# Altium schematic sheet MaUWB.SchDoc
size A; SheetNumber: 3; SheetTotal: 5
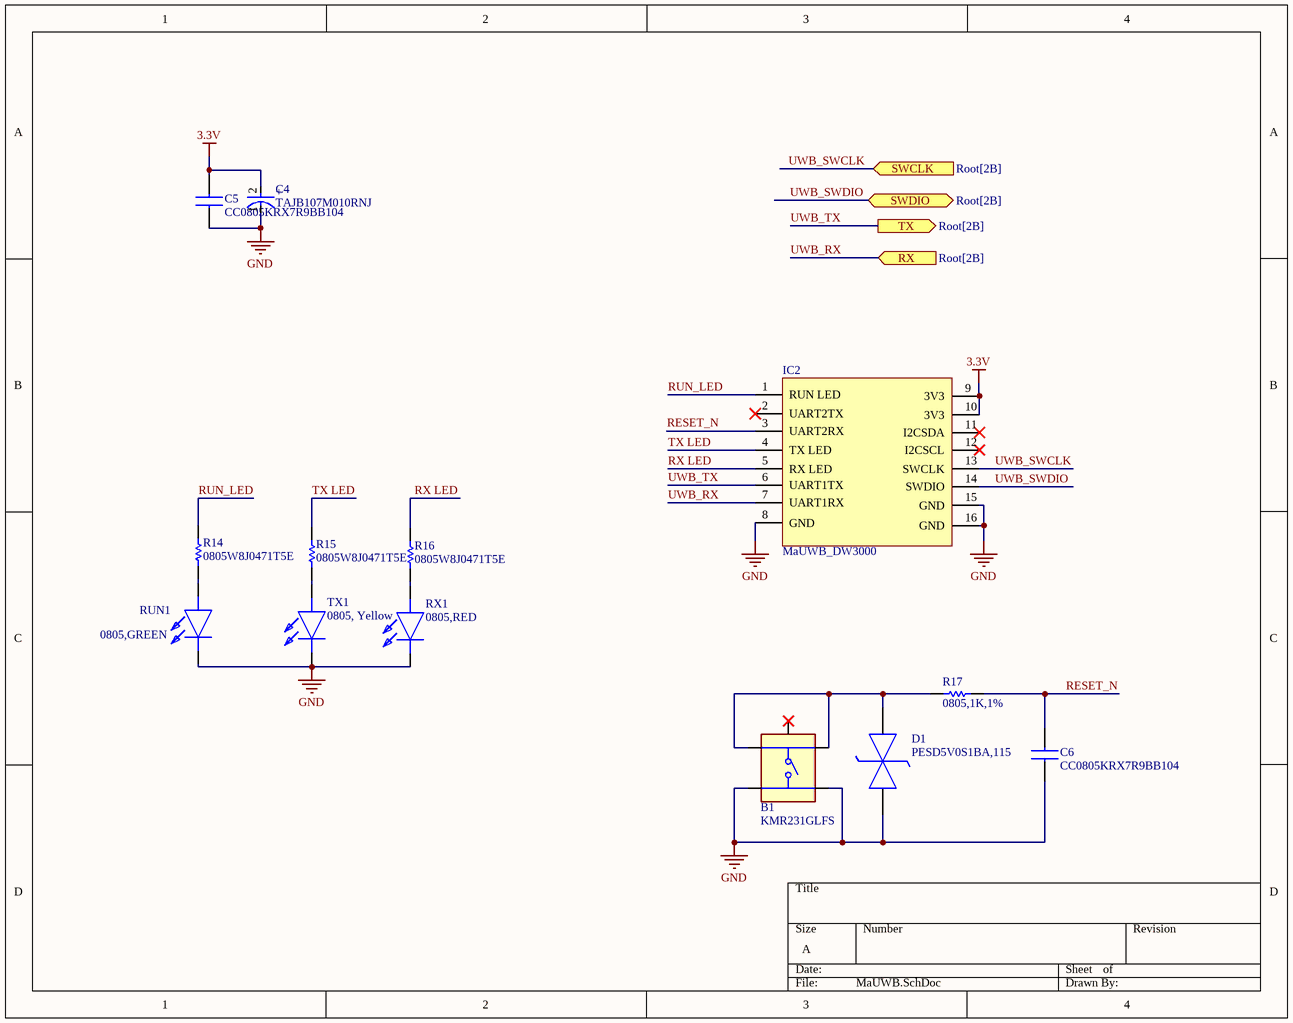
[diagram p0: MaUWB.SchDoc]

## Parts
B1  KMR231GLFS  [KMR231GLFS]
C4  TAJB107M010RNJ  [CAPPM3528X210N]
C5  CC0805KRX7R9BB104  [CAPC2012X95N]
C6  CC0805KRX7R9BB104  [CAPC2012X95N]
D1  PESD5V0S1BA,115  [SOD2512X110N]
IC2  MaUWB_DW3000  [MaUWB_DW3000]
R14  0805W8J0471T5E  [RESC2013X65N - Duplicate]
R15  0805W8J0471T5E  [RESC2013X65N - Duplicate]
R16  0805W8J0471T5E  [RESC2013X65N - Duplicate]
R17  0805,1K,1%  [RESC2013X65N - Duplicate2]
RUN1  0805,GREEN  [LEDC2012X120N]
RX1  0805,RED  [LEDC2012X120N - Duplicate]
TX1  0805, Yellow  [LEDC2012X120N - Duplicate]

## Ports
RX (in, see Root[2B]), SWCLK (in, see Root[2B]), SWDIO (bidir, see Root[2B]), TX (out, see Root[2B])

## Nets
3.3V: C4.2(A) C5.2 IC2.9(3V3) IC2.10(3V3)
GND: B1.3 B1.4 C4.1(C) C5.1 C6.1 D1.1(K1) IC2.8(GND) IC2.15(GND) IC2.16(GND) RUN1.1(K) RX1.1(K) TX1.1(K)
RESET_N: C6.2 IC2.3(UART2RX) R17.2
RUN_LED: IC2.1(RUN_LED) R14.2
RX LED: IC2.5(RX_LED) R16.2
TX LED: IC2.4(TX_LED) R15.2
UWB_RX: IC2.7(UART1RX) ; port RX
UWB_SWCLK: IC2.13(SWCLK) ; port SWCLK
UWB_SWDIO: IC2.14(SWDIO) ; port SWDIO
UWB_TX: IC2.6(UART1TX) ; port TX
NetB1_1: B1.1 B1.2 D1.2(K2) R17.1
NetR14_1: R14.1 RUN1.2(A)
NetR15_1: R15.1 TX1.2(A)
NetR16_1: R16.1 RX1.2(A)

Not connected (* = marked no-connect by the designer): B1 5*; IC2 2(UART2TX)* 11(I2CSDA)* 12(I2CSCL)*

## Notes on the sheet
- (in symbol TAJB107M010RNJ) +

## Library data of the parts
B1 = KMR231GLFS: Tactile Switch SPST 300gf 1.9mm Gull Wing 4.6mm x 2.8mm Surface Mount; LCSC Part #: C99271; Manu Part #: KMR231GLFS
C4 = TAJB107M010RNJ: 100uF, Tantalum; Manufacturer_Name: Kyocera AVX; LCSC part #: C7196; Manu Part #: TAJB107M010RNJ
C5 C6 = CC0805KRX7R9BB104: 100nF, 0805, X7R; Manufacturer_Name: Yageo Group; LCSC Part #: C49678; Manu Part #: CC0805KRX7R9BB104
D1 = PESD5V0S1BA,115: 14VC Clamp 12A@8/20us Ipp ESD DIODE SOD-323; Manu Part #: PESD5V0S1BA,115; LCSC Part #: C19224
R14-R16 = 0805W8J0471T5E: 470, 0805, 5%; Manufacturer_Name: ROYALOHM; Manu Part #: 0805W8F4700T5E; LCSC Part #: C17710
R17 = 0805W8F1001T5E: -55℃~+155℃ 125mW 150V 1kΩ Thick Film Resistor ±1% ±100ppm/℃ 0805 Chip Resistor - Surface Mount ROHS; Manu Part #: 0805W8F1001T5E; LCSC Part #: C17513
RUN1 = LTST-C170GKT: Green 569nm LED Indication - Discrete 2.1V 0805 (2012 Metric); Manufacturer_Name: Lite-On; Height: 1.2mm; Datasheet Link: https://mm.digikey.com/Volume0/opasdata/d220001/medias/docus/895/LTST-C170GKT.pdf; Manufacturer_Part_Number: LTST-C170GKT; Mouser Part Number: 859-LTST-C170GKT; Mouser Price/Stock: https://www.mouser.co.uk/ProductDetail/LITEON/LTST-C170GKT?qs=%2FSqKn2EfXQSV5aRij3YIfQ%3D%3D; Arrow Part Number: LTST-C170GKT; Arrow Price/Stock: https://www.arrow.com/en/products/ltst-c170gkt/lite-on-technology?utm_currency=USD&region=nac; Manu Part #: LTST-C170GKT; LCSC Part #: C125090
RX1 = LTST-C170KRKT: Red 631nm LED Indication - Discrete 2V 0805 (2012 Metric); Manufacturer_Name: Lite-On; Datasheet Link: https://componentsearchengine.com/Datasheets/1/LTST-C170KRKT.pdf; Height: 1.2mm; Manufacturer_Part_Number: LTST-C170KRKT; Mouser Part Number: 859-LTST-C170KRKT; Mouser Price/Stock: https://www.mouser.co.uk/ProductDetail/LITEON/LTST-C170KRKT?qs=NUb82WqeCyrVOID%2Fxt4rgA%3D%3D; Arrow Part Number: LTST-C170KRKT; Arrow Price/Stock: https://www.arrow.com/en/products/ltst-c170krkt/lite-on-technology?utm_currency=USD&region=nac; Manu Part #: LTST-C170KRKT; LCSC Part #: C94868
TX1 = KT-0603W: Yellow 631nm LED Indication - Discrete 2V 0805 (2012 Metric); Manufacturer_Name: Hubei KENTO Elec; Manu Part #: KT-0603W; LCSC Part #: C2290